# EAGLE design sensor (EAGLE 6.4)
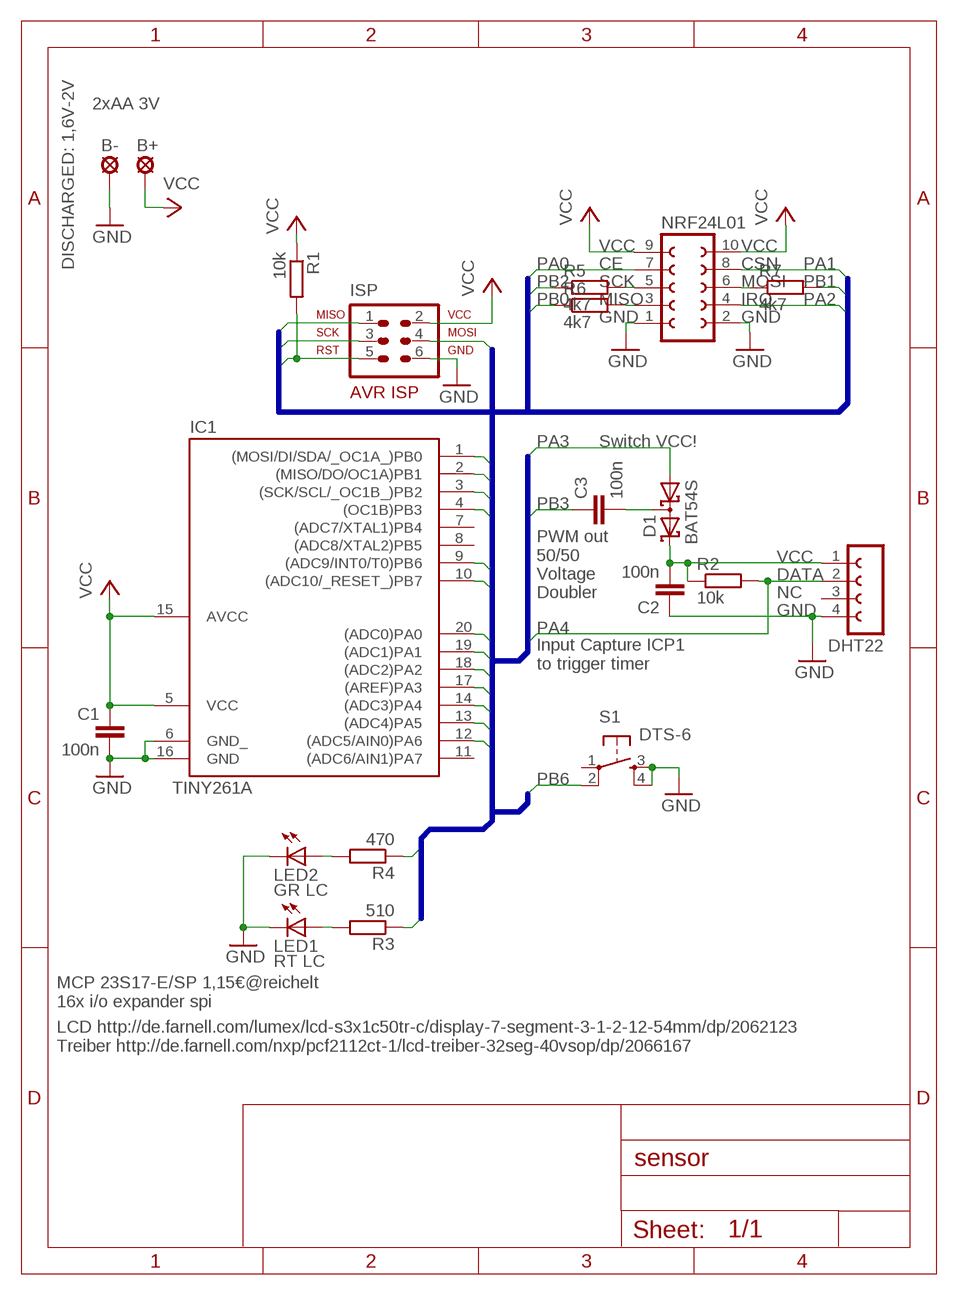
[diagram p0: schematic, sheet 1]

## Parts
B+  LSP11  [LSP11]
B-  LSP11  [LSP11]
C1  100n  C-EUC0805  [C0805]
C2  100n  C-EUC0805  [C0805]
C3  100n  C-EUC0805  [C0805]
D1  BAT54S  [SOT23]
DHT22  FE04-1  [FE04-1]
IC1  TINY261A  TINY26P  [DIL20]
ISP  ML6  AVR-ISP-6VERT  [AVR-ISP-6]
LED1  RT LC  LED5MM  [LED5MM]
LED2  GR LC  LED5MM  [LED5MM]
NRF24L01  FE05-2  [FE05-2]
R1  10k  R-EU_R0805  [R0805]
R2  10k  R-EU_R0805  [R0805]
R3  510  R-EU_R0805  [R0805]
R4  470  R-EU_R0805  [R0805]
R5  4k7  R-EU_0207/7  [0207/7]
R6  4k7  R-EU_0207/7  [0207/7]
R7  4k7  R-EU_0207/7  [0207/7]
S1  DTS-6  [DTS-6]

## Nets
DHTVCC: C2.2 D1.2(C2) DHT22.1 R2.1
GND: B-.MP C1.2 C2.1 DHT22.4 IC1.6(GND_) IC1.16(GND) ISP.6 LED1.K(C) LED2.K(C) NRF24L01.1 NRF24L01.2 S1.3 S1.4
N$1: LED2.A R4.2
N$2: C3.2 D1.3(C1A2)
N$3: NRF24L01.5 R5.2
N$4: NRF24L01.3 R6.2
N$5: NRF24L01.6 R7.1
N$13: LED1.A R3.2
PA0: IC1.20((ADC0)PA0) NRF24L01.7
PA1: IC1.19((ADC1)PA1) NRF24L01.8
PA2: IC1.18((ADC2)PA2) NRF24L01.4
PA3: D1.1(A1) IC1.17((AREF)PA3)
PA4: DHT22.2 IC1.14((ADC3)PA4) R2.2
PA5: IC1.13((ADC4)PA5) R3.1
PA6: IC1.12((ADC5/AIN0)PA6) R4.1
PB0: IC1.1((MOSI/DI/SDA/_OC1A_)PB0) ISP.4 R6.1
PB1: IC1.2((MISO/DO/OC1A)PB1) ISP.1 R7.2
PB2: IC1.3((SCK/SCL/_OC1B_)PB2) ISP.3 R5.1
PB3: C3.1 IC1.4((OC1B)PB3)
PB6: IC1.9((ADC9/INT0/T0)PB6) S1.2
PB7: IC1.10((ADC10/_RESET_)PB7) ISP.5 R1.2
VCC: B+.MP C1.1 IC1.5(VCC) IC1.15(AVCC) ISP.2 NRF24L01.9 NRF24L01.10 R1.1
Unconnected: DHT22.3 IC1.7((ADC7/XTAL1)PB4) IC1.8((ADC8/XTAL2)PB5) IC1.11((ADC6/AIN1)PA7) S1.1

## Buses
IO:PA[0..7],PB[0..7]

## Notes on the sheet
- 2xAA 3V
- VCC | VCC
- DISCHARGED: 1,6V-2V | CE | CSN
- SCK | MOSI
- MISO | IRQ
- GND | GND
- Switch VCC!
- VCC
- DATA
- PWM out 
  50/50
  Voltage
  Doubler
- NC
- GND
- Input Capture ICP1
  to trigger timer
- MCP 23S17-E/SP 1,15€@reichelt
  16x i/o expander spi
- LCD http://de.farnell.com/lumex/lcd-s3x1c50tr-c/display-7-segment-3-1-2-12-54mm/dp/2062123
  Treiber http://de.farnell.com/nxp/pcf2112ct-1/lcd-treiber-32seg-40vsop/dp/2066167

## Library data of the parts
B+ B- = solpad:LSP11: SOLDER PAD drill 1.1 mm
C1-C3 = rcl:C-EU: CAPACITOR, European symbol
D1 = diode:BAT54S: Schottky Diodes Pin connection corrected 2011-05-04 Source: Fairchild .. BAT54.pdf
DHT22 = con-lsta:FE04-1: FEMALE HEADER
IC1 = avr-7:TINY26: Atmel Tiny26/261/461/861
ISP = avr-7:AVR-ISP-6: AVR ISP-6 Serial Programming Header
LED1 = led:LED: LED OSRAM: - CHIPLED LG R971, LG N971, LY N971, LG Q971, LY Q971, LO R971, LY R971 LH N974, LH R974 LS Q976, LO Q976, LY Q976 LO Q996 - Hyper CHIPLED LW Q18S LB Q993, LB Q99A, LB R99A - SideLED LS A670, LO A670, LY A670, LG A670, LP A670 LB A673, LV A673, LT A673, LW A673 LH A674 LY A675 LS A676, LA A676, LO A676, LY A676, LW A676 LS A679, LY A679, LG A679 - Hyper Micro SIDELED® LS Y876, LA Y876, LO Y876, LY Y876 LT Y87S - SmartLED LW L88C, LW L88S LB L89C, LB L89S, LG L890 LS L89K, LO L89K, LY L89K LS L896, LA L896, LO L896, LY L896 - TOPLED LS T670, LO T670, LY T670, LG T670, LP T670 LSG T670, LSP T670, LSY T670, LOP T670, LYG T670 LG T671, LOG T671, LSG T671 LB T673, LV T673, LT T673, LW T673 LH T674 LS T676, LA T676, LO T676, LY T676, LB T676, LH T676, LSB T676, LW T676 LB T67C, LV T67C, LT T67C, LS T67K, LO T67K, LY T67K, LW E67C LS E67B, LA E67B, LO E67B, LY E67B, LB E67C, LV E67C, LT E67C LW T67C LS T679, LY T679, LG T679 LS T770, LO T770, LY T770, LG T770, LP T770 LB T773, LV T773, LT T773, LW T773 LH T774 LS E675, LA E675, LY E675, LS T675 LS T776, LA T776, LO T776, LY T776, LB T776 LHGB T686 LT T68C, LB T68C - Hyper Mini TOPLED® LB M676 - Mini TOPLED Santana® LG M470 LS M47K, LO M47K, LY M47K Source: http://www.osram.convergy.de LUXEON: - LUMILED® LXK2-PW12-R00, LXK2-PW12-S00, LXK2-PW14-U00, LXK2-PW14-V00 LXK2-PM12-R00, LXK2-PM12-S00, LXK2-PM14-U00 LXK2-PE12-Q00, LXK2-PE12-R00, LXK2-PE12-S00, LXK2-PE14-T00, LXK2-PE14-U00 LXK2-PB12-K00, LXK2-PB12-L00, LXK2-PB12-M00, LXK2-PB14-N00, LXK2-PB14-P00, LXK2-PB14-Q00 LXK2-PR12-L00, LXK2-PR12-M00, LXK2-PR14-Q00, LXK2-PR14-R00 LXK2-PD12-Q00, LXK2-PD12-R00, LXK2-PD12-S00 LXK2-PH12-R00, LXK2-PH12-S00 LXK2-PL12-P00, LXK2-PL12-Q00, LXK2-PL12-R00 Source: www.luxeon.com KINGBRIGHT: KA-3528ASYC Source: www.kingbright.com; I: 2mA; U_F: 2V
LED2 = led:LED: LED OSRAM: - CHIPLED LG R971, LG N971, LY N971, LG Q971, LY Q971, LO R971, LY R971 LH N974, LH R974 LS Q976, LO Q976, LY Q976 LO Q996 - Hyper CHIPLED LW Q18S LB Q993, LB Q99A, LB R99A - SideLED LS A670, LO A670, LY A670, LG A670, LP A670 LB A673, LV A673, LT A673, LW A673 LH A674 LY A675 LS A676, LA A676, LO A676, LY A676, LW A676 LS A679, LY A679, LG A679 - Hyper Micro SIDELED® LS Y876, LA Y876, LO Y876, LY Y876 LT Y87S - SmartLED LW L88C, LW L88S LB L89C, LB L89S, LG L890 LS L89K, LO L89K, LY L89K LS L896, LA L896, LO L896, LY L896 - TOPLED LS T670, LO T670, LY T670, LG T670, LP T670 LSG T670, LSP T670, LSY T670, LOP T670, LYG T670 LG T671, LOG T671, LSG T671 LB T673, LV T673, LT T673, LW T673 LH T674 LS T676, LA T676, LO T676, LY T676, LB T676, LH T676, LSB T676, LW T676 LB T67C, LV T67C, LT T67C, LS T67K, LO T67K, LY T67K, LW E67C LS E67B, LA E67B, LO E67B, LY E67B, LB E67C, LV E67C, LT E67C LW T67C LS T679, LY T679, LG T679 LS T770, LO T770, LY T770, LG T770, LP T770 LB T773, LV T773, LT T773, LW T773 LH T774 LS E675, LA E675, LY E675, LS T675 LS T776, LA T776, LO T776, LY T776, LB T776 LHGB T686 LT T68C, LB T68C - Hyper Mini TOPLED® LB M676 - Mini TOPLED Santana® LG M470 LS M47K, LO M47K, LY M47K Source: http://www.osram.convergy.de LUXEON: - LUMILED® LXK2-PW12-R00, LXK2-PW12-S00, LXK2-PW14-U00, LXK2-PW14-V00 LXK2-PM12-R00, LXK2-PM12-S00, LXK2-PM14-U00 LXK2-PE12-Q00, LXK2-PE12-R00, LXK2-PE12-S00, LXK2-PE14-T00, LXK2-PE14-U00 LXK2-PB12-K00, LXK2-PB12-L00, LXK2-PB12-M00, LXK2-PB14-N00, LXK2-PB14-P00, LXK2-PB14-Q00 LXK2-PR12-L00, LXK2-PR12-M00, LXK2-PR14-Q00, LXK2-PR14-R00 LXK2-PD12-Q00, LXK2-PD12-R00, LXK2-PD12-S00 LXK2-PH12-R00, LXK2-PH12-S00 LXK2-PL12-P00, LXK2-PL12-Q00, LXK2-PL12-R00 Source: www.luxeon.com KINGBRIGHT: KA-3528ASYC Source: www.kingbright.com; I: 2.2mA; U_F: 2V2
NRF24L01 = con-lsta:FE05-2: FEMALE HEADER; OC_FARNELL: unknown; OC_NEWARK: unknown
R1-R7 = rcl:R-EU_: RESISTOR, European symbol
S1 = switch-tact:DTS-6

## Board
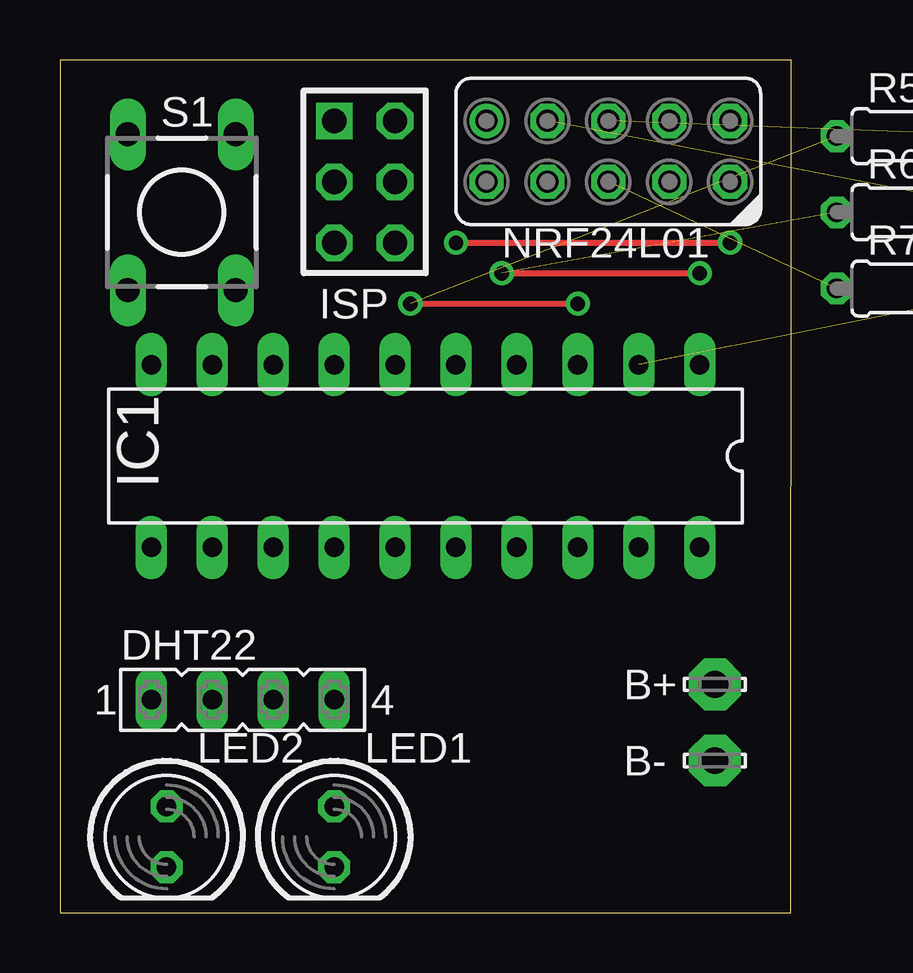
[diagram p1: board, top side]
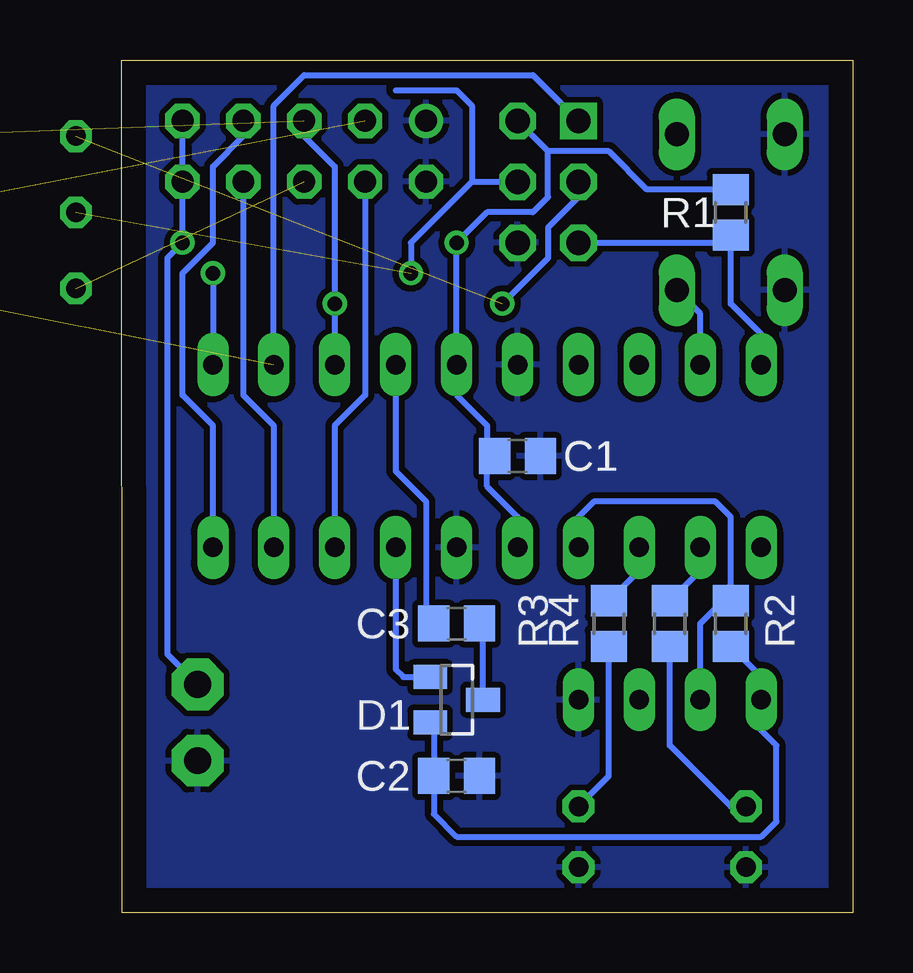
[diagram p2: board, bottom side, seen from below]

Size 30.48 x 35.56 mm. Coordinates in mm from the lower left corner, seen from the top.
Outline: 0,0 30.46,0 30.48,35.56 0,35.56 0,0
Copper layers (1*16): Top 0.035mm / dielectric 1.5mm / Bottom 0.035mm
Design rules "bilex-cust *": minimum track width 10mil, minimum drill 0.4mm, track to track 10mil, track to pad 10mil, pad to pad 10mil, via to via 10mil, smd to smd 10mil, copper to edge 40mil, drill to drill 8mil, minimum pad ring 10mil, minimum via ring 8mil, stop-mask expansion 4mil, vias tented up to drill 0mil, thermal gap 10mil

### Footprints (pad centres in the part's own frame; a part is rotated, then mirrored left to right if it is on the bottom)
LSP11 = drill 1.118 pad 2.159 octagon: MP 0,0
C0805 = smd 1.3 x 1.5: 1 -0.95,0; 2 0.95,0
SOT23 = smd 1 x 1.4: 1 -0.95,-1.1; 2 0.95,-1.1; 3 0,1.1
FE04-1 = drill 0.813 long: 1 -3.81,0; 2 -1.27,0; 3 1.27,0; 4 3.81,0
DIL20 = drill 0.813 long: 1 -11.43,-3.81; 2 -8.89,-3.81; 3 -6.35,-3.81; 4 -3.81,-3.81; 5 -1.27,-3.81; 6 1.27,-3.81; 7 3.81,-3.81; 8 6.35,-3.81; 9 8.89,-3.81; 10 11.43,-3.81; 11 11.43,3.81; 12 8.89,3.81; 13 6.35,3.81; 14 3.81,3.81; 15 1.27,3.81; 16 -1.27,3.81; 17 -3.81,3.81; 18 -6.35,3.81; 19 -8.89,3.81; 20 -11.43,3.81
AVR-ISP-6 = drill 1.016 square: 1 -2.54,-1.27 | drill 1.016 octagon: 2 -2.54,1.27; 3 0,-1.27; 4 0,1.27; 5 2.54,-1.27; 6 2.54,1.27
LED5MM = drill 0.813 octagon: A -1.27,0; K 1.27,0
FE05-2 = drill 0.914: 1 -5.08,1.27 | drill 0.914 octagon: 2 -5.08,-1.27; 3 -2.54,1.27; 4 -2.54,-1.27; 5 0,1.27; 6 0,-1.27; 7 2.54,1.27; 8 2.54,-1.27; 9 5.08,1.27; 10 5.08,-1.27
R0805 = smd 1.3 x 1.5: 1 -0.95,0; 2 0.95,0
0207/7 = drill 0.813 octagon: 1 -3.81,0; 2 3.81,0
DTS-6 = drill 1 long: 1 -3.25,2.25; 2 3.25,2.25; 3 -3.25,-2.25; 4 3.25,-2.25

### Placement (x,y rotation side)
B+  27.3,9.53 0 top
B-  27.3,6.35 0 top
C1  13.97,19.05 0 bottom
C2  16.51,5.71 180 bottom
C3  16.51,12.06 0 bottom
D1  16.51,8.89 270 bottom
DHT22  7.62,8.89 0 top
IC1  15.24,19.05 180 top
ISP  12.7,30.48 270 top
LED1  11.43,3.17 270 top
LED2  4.45,3.17 270 top
NRF24L01  22.86,31.75 0 top
R1  5.08,29.21 270 bottom
R2  5.08,12.06 90 bottom
R3  10.16,12.06 270 bottom
R4  7.62,12.06 270 bottom
R5  36.2,32.38 0 top
R6  36.2,29.21 0 top
R7  36.2,26.04 0 top
S1  5.08,29.21 270 top

### Tracks (layer width: path | path; a pad name or v marks a point on that pad's centre or on a via)
DHTVCC
  Bottom 0.254: D1.2 17.46,7.79 C2.2 17.46,4.12 16.51,3.17 3.81,3.17 3.17,3.81 3.17,6.99 3.81,7.62 DHT22.1 3.81,9.85 R2.1
GND
  pour Bottom: -0.64,36.2 31.11,36.2 31.11,-0.64 -0.64,-0.64
N$1
  Bottom 0.254: LED2.A 5.08,4.45 7.62,6.99 R4.2
N$2
  Bottom 0.254: D1.3 15.41,11.91 C3.2
N$3  (1 unrouted)
N$4  (1 unrouted)
N$5  (1 unrouted)
N$13
  Bottom 0.254: LED1.A 10.16,5.71 R3.2
PA0
  Bottom 0.254: IC1.20 26.67,20.32 27.94,21.59 27.94,26.67 26.67,27.94 26.67,31.11 25.4,32.38 NRF24L01.7
PA1
  Bottom 0.254: NRF24L01.8 25.4,21.59 24.13,20.32 IC1.19
PA2
  Bottom 0.254: IC1.18 21.59,20.32 20.32,21.59 NRF24L01.4
PA3
  Bottom 0.254: IC1.17 19.05,10.16 18.73,9.84 D1.1
PA4
  Bottom 0.254: IC1.14 11.43,16.51 10.79,17.14 5.71,17.14 5.08,16.51 R2.2 5.4,13.02 6.35,12.06 DHT22.2
PA5
  Bottom 0.254: IC1.13 8.89,14.29 R3.1
PA6
  Bottom 0.254: IC1.12 6.35,14.29 R4.1
PB0  (via drill 0.6)  (1 unrouted)
  Top 0.254: v18.41,26.67 v26.67,26.67
  Bottom 0.254: 15.88,30.48 18.41,27.94 v18.41,26.67 | v26.67,26.67 IC1.1 | 19.05,34.29 16.51,34.29 15.88,33.66 15.88,30.48 | 15.88,30.48 ISP.4
PB1  (1 unrouted)
  Bottom 0.254: IC1.2 24.13,33.66 22.86,34.92 13.34,34.92 ISP.1
PB2  (via drill 0.6)  (1 unrouted)
  Top 0.254: v14.61,25.4 v21.59,25.4
  Bottom 0.254: 22.86,32.38 21.59,31.11 v21.59,25.4 IC1.3 | ISP.3 11.43,29.84 12.7,28.57 12.7,27.3 v14.61,25.4
PB3
  Bottom 0.254: IC1.4 19.05,18.41 17.78,17.14 17.78,12.38 C3.1 17.14,12.38
PB6
  Bottom 0.254: IC1.9 6.35,24.98 S1.2
PB7
  Bottom 0.254: IC1.10 3.81,24.13 5.08,25.4 R1.2 5.4,27.94 ISP.5
VCC  (via drill 0.6)
  Top 0.254: v16.51,27.94 v27.94,27.94
  Bottom 0.254: NRF24L01.9 NRF24L01.10 v27.94,27.94 28.57,27.3 28.57,10.79 B+.MP | 12.7,31.75 12.7,29.84 13.34,29.21 15.24,29.21 v16.51,27.94 IC1.5 16.51,21.59 15.24,20.32 15.24,19.37 C1.1 15.24,18.73 15.24,17.78 13.97,16.51 IC1.15 | R1.1 8.57,30.16 10.16,31.75 12.7,31.75 | 12.7,31.75 ISP.2